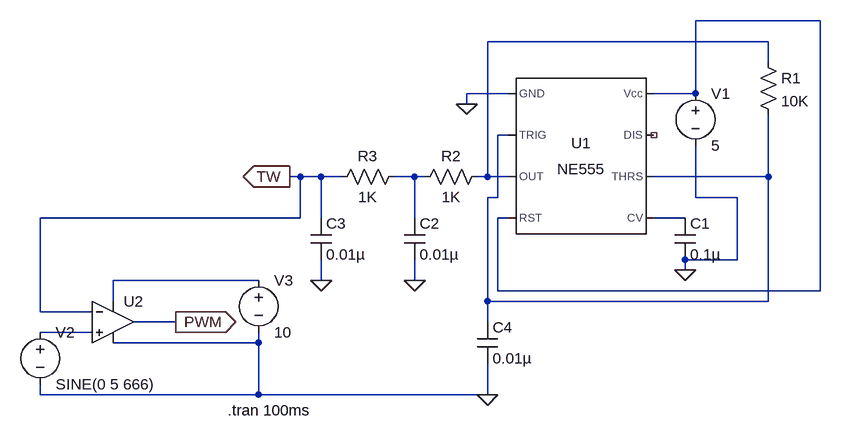
[diagram p0: schematic PWM wave.asc]
PWM wave.asc, the LTspice schematic file:
Version 4
SHEET 1 880 680
WIRE 608 32 416 32
WIRE 528 64 96 64
WIRE 528 96 528 64
WIRE 128 144 64 144
WIRE 416 144 416 32
WIRE 416 144 352 144
WIRE 64 160 64 144
WIRE 128 208 112 208
WIRE -192 272 -208 272
WIRE -160 272 -192 272
WIRE -128 272 -160 272
WIRE -16 272 -48 272
WIRE 0 272 -16 272
WIRE 96 272 96 64
WIRE 96 272 80 272
WIRE 128 272 96 272
WIRE 528 272 528 176
WIRE 528 272 352 272
WIRE 112 304 112 208
WIRE 112 304 96 304
WIRE 416 304 416 224
WIRE 480 304 416 304
WIRE -192 336 -192 272
WIRE -192 336 -592 336
WIRE -160 336 -160 272
WIRE -16 336 -16 272
WIRE 128 336 112 336
WIRE 400 336 352 336
WIRE 480 400 480 304
WIRE 480 400 400 400
WIRE 400 416 400 400
WIRE -256 432 -480 432
WIRE -160 432 -160 400
WIRE -16 432 -16 400
WIRE 112 448 112 336
WIRE 608 448 608 32
WIRE 608 448 112 448
WIRE -480 464 -480 432
WIRE 96 464 96 304
WIRE 528 464 528 272
WIRE 528 464 96 464
WIRE -592 480 -592 336
WIRE -512 480 -592 480
WIRE -384 496 -448 496
WIRE 96 496 96 464
WIRE -512 512 -592 512
WIRE -256 528 -256 512
WIRE -256 528 -480 528
WIRE -592 608 -592 592
WIRE -256 608 -256 528
WIRE -256 608 -592 608
WIRE 96 608 96 560
WIRE 96 608 -256 608
FLAG 64 160 0
FLAG -16 432 0
FLAG -160 432 0
FLAG 400 416 0
FLAG 96 608 0
FLAG -208 272 TW
IOPIN -208 272 Out
FLAG -384 496 PWM
IOPIN -384 496 Out
SYMBOL Misc\\NE555 240 240 R0
SYMATTR InstName U1
SYMBOL cap 384 336 R0
SYMATTR InstName C1
SYMATTR Value 0.1µ
SYMATTR SpiceLine V=4 Irms=0 Rser=0 Lser=0 mfg="Murata" pn="GRM011R60G103KE01" type="X5R"
SYMBOL cap -32 336 R0
SYMATTR InstName C2
SYMATTR Value 0.01µ
SYMATTR SpiceLine V=4 Irms=162m Rser=0.395426 Lser=0 mfg="KEMET" pn="C0402C103K7PAC" type="X5R"
SYMBOL cap -176 336 R0
SYMATTR InstName C3
SYMATTR Value 0.01µ
SYMATTR SpiceLine V=4 Irms=162m Rser=0.395426 Lser=0 mfg="KEMET" pn="C0402C103K7PAC" type="X5R"
SYMBOL res 512 80 R0
SYMATTR InstName R1
SYMATTR Value 10K
SYMATTR SpiceLine tol=1 pwr=0.1
SYMBOL res 96 256 R90
WINDOW 0 0 56 VBottom 2
WINDOW 3 32 56 VTop 2
SYMATTR InstName R2
SYMATTR Value 1K
SYMATTR SpiceLine tol=1 pwr=0.1
SYMBOL res -32 256 R90
WINDOW 0 0 56 VBottom 2
WINDOW 3 32 56 VTop 2
SYMATTR InstName R3
SYMATTR Value 1K
SYMATTR SpiceLine tol=1 pwr=0.1
SYMBOL cap 80 496 R0
SYMATTR InstName C4
SYMATTR Value 0.01µ
SYMATTR SpiceLine V=4 Irms=162m Rser=0.395426 Lser=0 mfg="KEMET" pn="C0402C103K7PAC" type="X5R"
SYMBOL voltage 416 128 R0
WINDOW 123 0 0 Left 0
WINDOW 39 0 0 Left 0
SYMATTR InstName V1
SYMATTR Value 5
SYMBOL OpAmps\\UniversalOpamp2 -480 496 R0
SYMATTR InstName U2
SYMBOL voltage -592 496 R0
WINDOW 123 0 0 Left 0
WINDOW 39 0 0 Left 0
SYMATTR InstName V2
SYMATTR Value SINE(0 5 666)
SYMBOL voltage -256 416 R0
WINDOW 123 0 0 Left 0
WINDOW 39 0 0 Left 0
SYMATTR InstName V3
SYMATTR Value 10
TEXT -304 632 Left 2 !.tran 100ms

The netlist it stands for:
* PWM wave.asc
XU1 0 N003 N002 N001 N005 N003 NC_01 N001 NE555  ; pins GND TRIG OUT RST CV THRS DIS Vcc
C1 N005 0 0.1µ V=4 Irms=0 Rser=0 Lser=0 mfg="Murata" pn="GRM011R60G103KE01" type="X5R"
C2 N004 0 0.01µ V=4 Irms=162m Rser=0.395426 Lser=0 mfg="KEMET" pn="C0402C103K7PAC" type="X5R"
C3 TW 0 0.01µ V=4 Irms=162m Rser=0.395426 Lser=0 mfg="KEMET" pn="C0402C103K7PAC" type="X5R"
R1 N002 N003 10K tol=1 pwr=0.1
R2 N002 N004 1K tol=1 pwr=0.1
R3 N004 TW 1K tol=1 pwr=0.1
C4 N003 0 0.01µ V=4 Irms=162m Rser=0.395426 Lser=0 mfg="KEMET" pn="C0402C103K7PAC" type="X5R"
V1 N001 0 5
XU2 N007 TW N006 0 PWM level.2 Avol=1Meg GBW=10Meg Slew=10Meg ilimit=25m rail=0 Vos=0 phimargin=45 en=0 enk=0 in=0 ink=0 Rin=500Meg  ; pins IN+ IN- V+ V- OUT
V2 N007 0 SINE(0 5 666)
V3 N006 0 10
.tran 100ms
.lib NE555.sub
.lib UniversalOpamps2.sub
.backanno
.end